# Altium schematic sheet schema1.SchDoc
size A3; ApprovedBy: CdB; CheckedBy: CdB; DrawnBy: RT; Engineer: CdB; Organization: Faber Electronics B.V.; Address1: Th. Dobbeweg 1,; Address2: 6883 GN Velp,; Address3: Netherlands; Address4: T: 026-38 46 800; DocumentNumber: 1; Revision: 2.1.4; SheetNumber: 1; SheetTotal: 6; Status: Final; PageSetup: Record=PageOptions|CenterHorizontal=True|CenterVertical=True|PrintScale=1.01|XCorrection=1.00|YCorrection=1.00|PrintKind=1|BorderSize=5000000|LeftOffset=0|BottomOffset=0|Orientation=2|PaperLength=1000|PaperWidth=1000|Scale=100|PaperSource=7|PrintQuality=1200|MediaType=1|DitherType=10|PaperKind=A3 (297 x 420mm)|PrintScaleMode=1
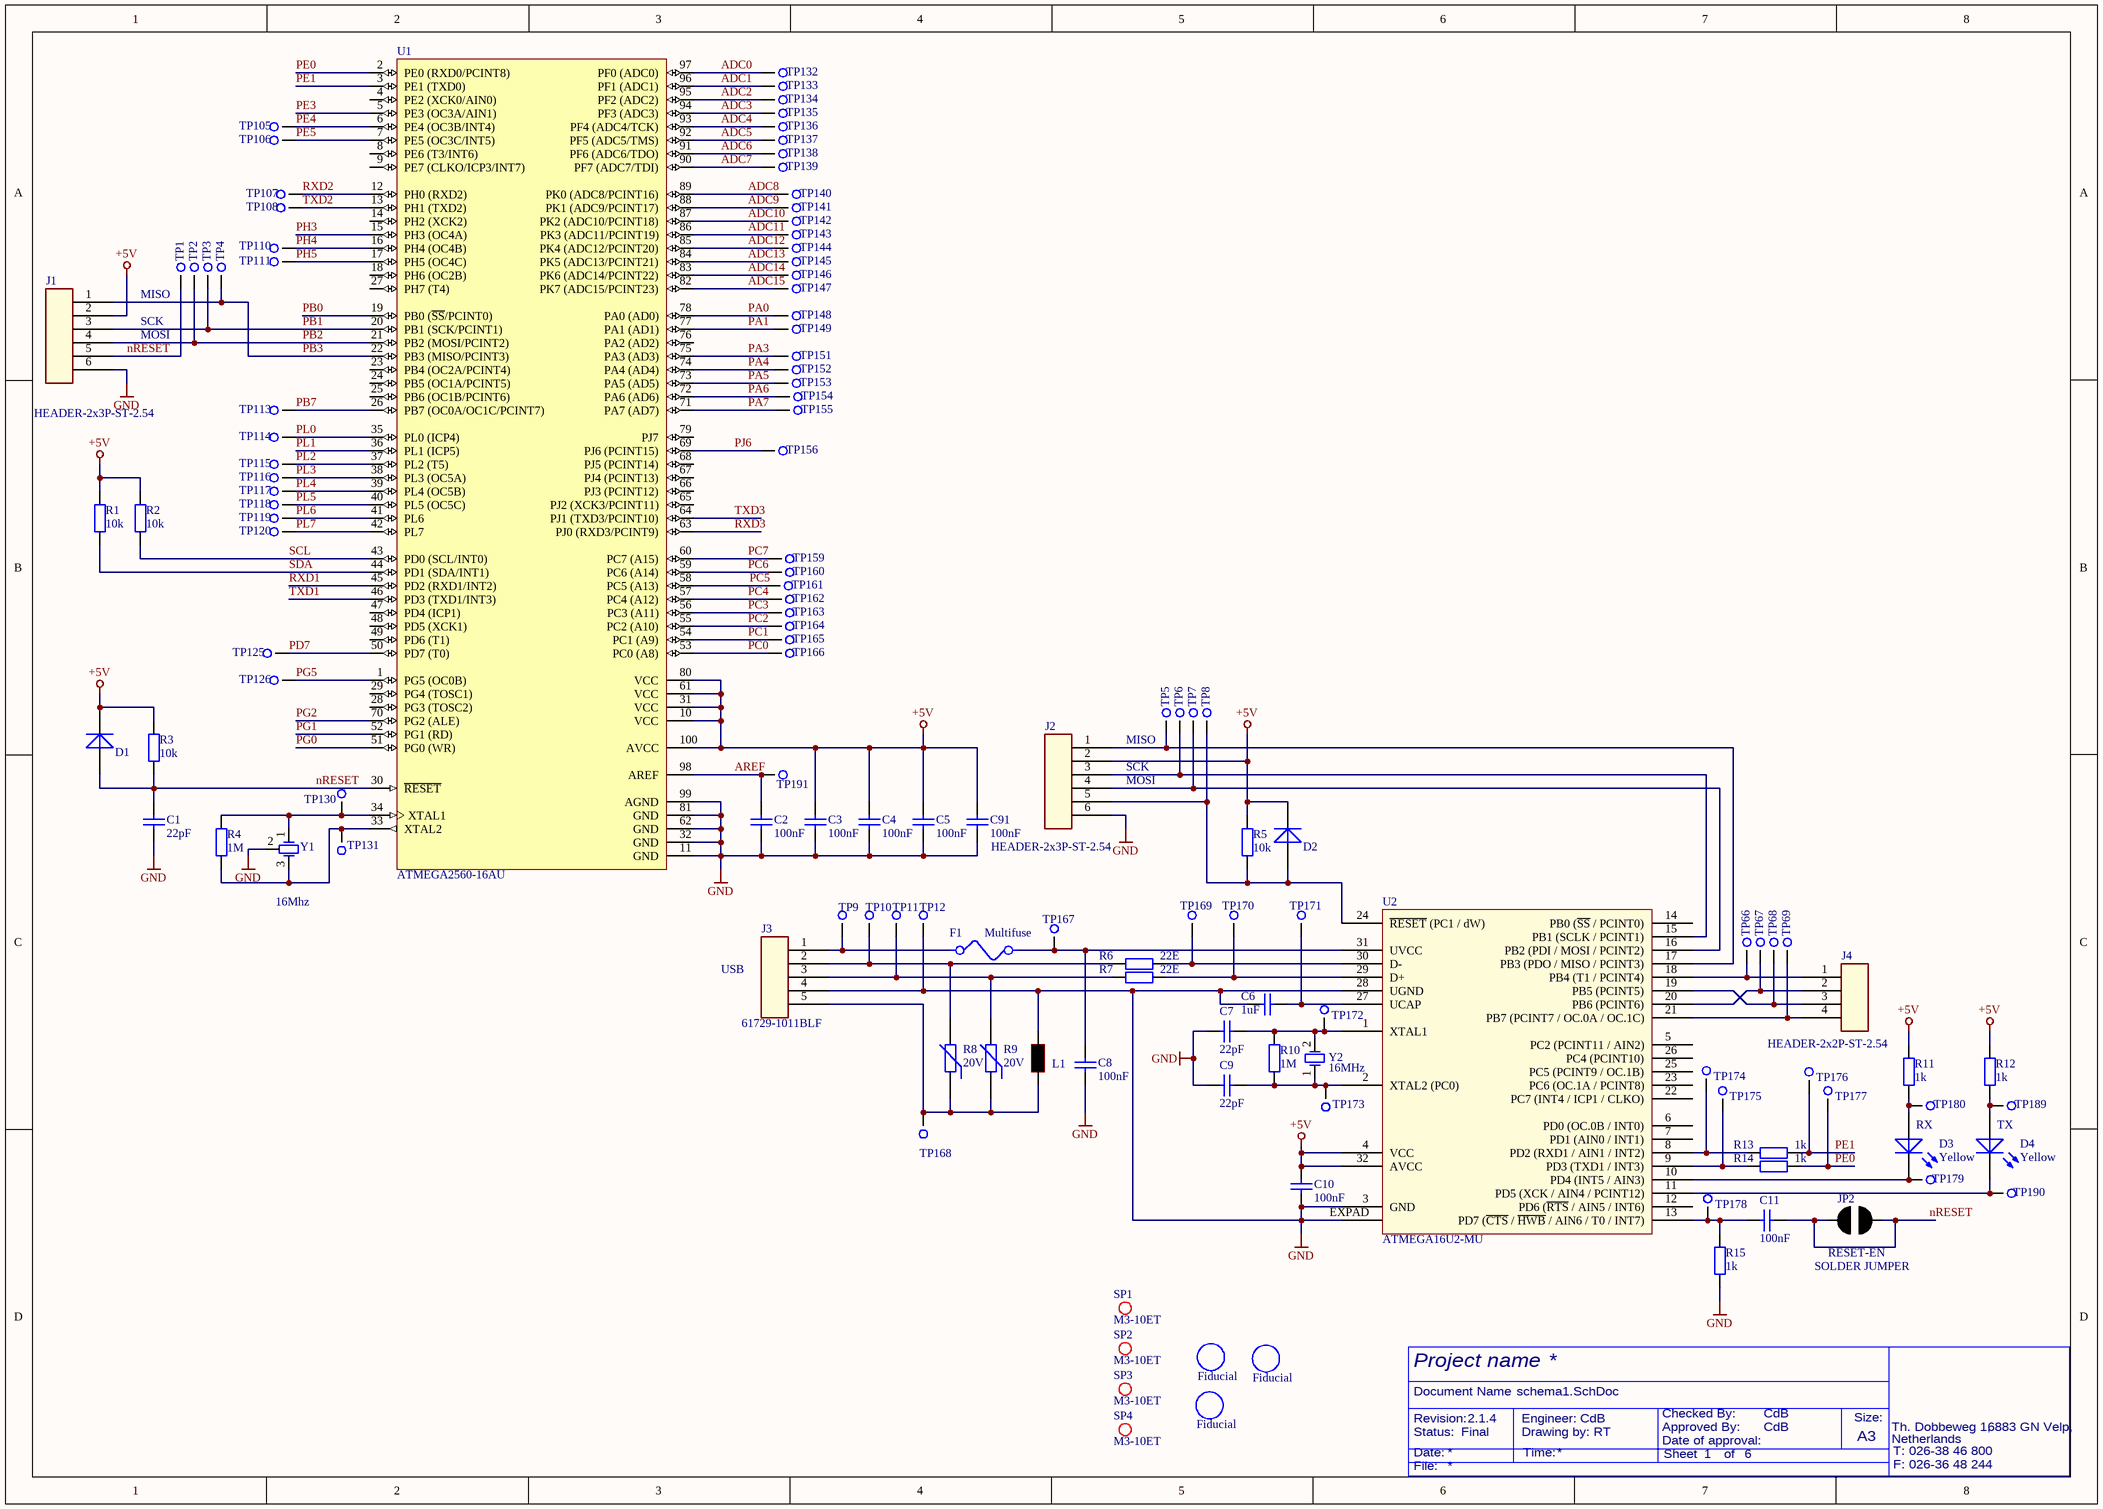
[diagram p0: schema1.SchDoc]

## Parts
C1  22pF  [C0603]
C2  100nF  [C0603]
C3  100nF  [C0603]
C4  100nF  [C0603]
C5  100nF  [C0603]
C6  1uF  [C0603]
C7  22pF  [C0603]
C8  100nF  [C0603]
C9  22pF  [C0603]
C10  100nF  [C0603]
C11  100nF  [C0603]
C91  100nF  [C0603]
D1  1N4148  [SOD323]  (value not drawn)
D2  1N4148  [SOD323]  (value not drawn)
D3  Yellow  [LED0805-YELLOW]
D4  Yellow  [LED0805-YELLOW]
F1  Multifuse  [Multifuse1812]
Fid1  Fiducial  [Fiducial]  (no BOM)
Fid2  Fiducial  [Fiducial]  (no BOM)
Fid3  Fiducial  [Fiducial]  (no BOM)
J1  HEADER-2x3P-ST-2.54  [HEADER-2x3P-ST-2.54]
J2  HEADER-2x3P-ST-2.54  [HEADER-2x3P-ST-2.54]
J3  61729-1011BLF  [61729-1011BLF]
J4  HEADER-2x2P-ST-2.54  [HEADER-2x2P-ST-2.54]
JP2  SOLDER JUMPER  [JUMPER 2 SOLDER]
L1  Bead  [L0805]  (value not drawn)
R1  10k  [R0603]
R2  10k  [R0603]
R3  10k  [R0603]
R4  1M  [R0603]
R5  10k  [R0603]
R6  22E  [R0603]
R7  22E  [R0603]
R8  20V  [R0603]
R9  20V  [R0603]
R10  1M  [R0603]
R11  1k  [R0603]
R12  1k  [R0603]
R13  1k  [R0603]
R14  1k  [R0603]
R15  1k  [R0603]
SP1  M3-10ET  [Spacer M3-10ET]
SP2  M3-10ET  [Spacer M3-10ET]
SP3  M3-10ET  [Spacer M3-10ET]
SP4  M3-10ET  [Spacer M3-10ET]
TP1  Testpoint  [Testpoint]  (value not drawn)
TP2  Testpoint  [Testpoint]  (value not drawn)
TP3  Testpoint  [Testpoint]  (value not drawn)
TP4  Testpoint  [Testpoint]  (value not drawn)
TP5  Testpoint  [Testpoint]  (value not drawn)
TP6  Testpoint  [Testpoint]  (value not drawn)
TP7  Testpoint  [Testpoint]  (value not drawn)
TP8  Testpoint  [Testpoint]  (value not drawn)
TP9  Testpoint  [Testpoint]  (value not drawn)
TP10  Testpoint  [Testpoint]  (value not drawn)
TP11  Testpoint  [Testpoint]  (value not drawn)
TP12  Testpoint  [Testpoint]  (value not drawn)
TP66  Testpoint  [Testpoint]  (value not drawn)
TP67  Testpoint  [Testpoint]  (value not drawn)
TP68  Testpoint  [Testpoint]  (value not drawn)
TP69  Testpoint  [Testpoint]  (value not drawn)
TP105  Testpoint 1.6mm  [Testpoint 1.6mm]  (value not drawn)
TP106  Testpoint 1.6mm  [Testpoint 1.6mm]  (value not drawn)
TP107  Testpoint 1.6mm  [Testpoint 1.6mm]  (value not drawn)
TP108  Testpoint 1.6mm  [Testpoint 1.6mm]  (value not drawn)
TP110  Testpoint 1.6mm  [Testpoint 1.6mm]  (value not drawn)
TP111  Testpoint 1.6mm  [Testpoint 1.6mm]  (value not drawn)
TP113  Testpoint 1.6mm  [Testpoint 1.6mm]  (value not drawn)
TP114  Testpoint 1.6mm  [Testpoint 1.6mm]  (value not drawn)
TP115  Testpoint 1.6mm  [Testpoint 1.6mm]  (value not drawn)
TP116  Testpoint 1.6mm  [Testpoint 1.6mm]  (value not drawn)
TP117  Testpoint 1.6mm  [Testpoint 1.6mm]  (value not drawn)
TP118  Testpoint 1.6mm  [Testpoint 1.6mm]  (value not drawn)
TP119  Testpoint 1.6mm  [Testpoint 1.6mm]  (value not drawn)
TP120  Testpoint 1.6mm  [Testpoint 1.6mm]  (value not drawn)
TP125  Testpoint 1.6mm  [Testpoint 1.6mm]  (value not drawn)
TP126  Testpoint 1.6mm  [Testpoint 1.6mm]  (value not drawn)
TP130  Testpoint 1.6mm  [Testpoint 1.6mm]  (value not drawn)
TP131  Testpoint 1.6mm  [Testpoint 1.6mm]  (value not drawn)
TP132  Testpoint 1.6mm  [Testpoint 1.6mm]  (value not drawn)
TP133  Testpoint 1.6mm  [Testpoint 1.6mm]  (value not drawn)
TP134  Testpoint 1.6mm  [Testpoint 1.6mm]  (value not drawn)
TP135  Testpoint 1.6mm  [Testpoint 1.6mm]  (value not drawn)
TP136  Testpoint 1.6mm  [Testpoint 1.6mm]  (value not drawn)
TP137  Testpoint 1.6mm  [Testpoint 1.6mm]  (value not drawn)
TP138  Testpoint 1.6mm  [Testpoint 1.6mm]  (value not drawn)
TP139  Testpoint 1.6mm  [Testpoint 1.6mm]  (value not drawn)
TP140  Testpoint 1.6mm  [Testpoint 1.6mm]  (value not drawn)
TP141  Testpoint 1.6mm  [Testpoint 1.6mm]  (value not drawn)
TP142  Testpoint 1.6mm  [Testpoint 1.6mm]  (value not drawn)
TP143  Testpoint 1.6mm  [Testpoint 1.6mm]  (value not drawn)
TP144  Testpoint 1.6mm  [Testpoint 1.6mm]  (value not drawn)
TP145  Testpoint 1.6mm  [Testpoint 1.6mm]  (value not drawn)
TP146  Testpoint 1.6mm  [Testpoint 1.6mm]  (value not drawn)
TP147  Testpoint 1.6mm  [Testpoint 1.6mm]  (value not drawn)
TP148  Testpoint 1.6mm  [Testpoint 1.6mm]  (value not drawn)
TP149  Testpoint 1.6mm  [Testpoint 1.6mm]  (value not drawn)
TP151  Testpoint 1.6mm  [Testpoint 1.6mm]  (value not drawn)
TP152  Testpoint 1.6mm  [Testpoint 1.6mm]  (value not drawn)
TP153  Testpoint 1.6mm  [Testpoint 1.6mm]  (value not drawn)
TP154  Testpoint 1.6mm  [Testpoint 1.6mm]  (value not drawn)
TP155  Testpoint 1.6mm  [Testpoint 1.6mm]  (value not drawn)
TP156  Testpoint 1.6mm  [Testpoint 1.6mm]  (value not drawn)
TP159  Testpoint 1.6mm  [Testpoint 1.6mm]  (value not drawn)
TP160  Testpoint 1.6mm  [Testpoint 1.6mm]  (value not drawn)
TP161  Testpoint 1.6mm  [Testpoint 1.6mm]  (value not drawn)
TP162  Testpoint 1.6mm  [Testpoint 1.6mm]  (value not drawn)
TP163  Testpoint 1.6mm  [Testpoint 1.6mm]  (value not drawn)
TP164  Testpoint 1.6mm  [Testpoint 1.6mm]  (value not drawn)
TP165  Testpoint 1.6mm  [Testpoint 1.6mm]  (value not drawn)
TP166  Testpoint 1.6mm  [Testpoint 1.6mm]  (value not drawn)
TP167  Testpoint 1.6mm  [Testpoint 1.6mm]  (value not drawn)
TP168  Testpoint 1.6mm  [Testpoint 1.6mm]  (value not drawn)
TP169  Testpoint 1.6mm  [Testpoint 1.6mm]  (value not drawn)
TP170  Testpoint 1.6mm  [Testpoint 1.6mm]  (value not drawn)
TP171  Testpoint 1.6mm  [Testpoint 1.6mm]  (value not drawn)
TP172  Testpoint 1.6mm  [Testpoint 1.6mm]  (value not drawn)
TP173  Testpoint 1.6mm  [Testpoint 1.6mm]  (value not drawn)
TP174  Testpoint 1.6mm  [Testpoint 1.6mm]  (value not drawn)
TP175  Testpoint 1.6mm  [Testpoint 1.6mm]  (value not drawn)
TP176  Testpoint 1.6mm  [Testpoint 1.6mm]  (value not drawn)
TP177  Testpoint 1.6mm  [Testpoint 1.6mm]  (value not drawn)
TP178  Testpoint 1.6mm  [Testpoint 1.6mm]  (value not drawn)
TP179  Testpoint 1.6mm  [Testpoint 1.6mm]  (value not drawn)
TP180  Testpoint 1.6mm  [Testpoint 1.6mm]  (value not drawn)
TP189  Testpoint 1.6mm  [Testpoint 1.6mm]  (value not drawn)
TP190  Testpoint 1.6mm  [Testpoint 1.6mm]  (value not drawn)
TP191  Testpoint 1.6mm  [Testpoint 1.6mm]  (value not drawn)
U1  ATMEGA2560-16AU  [TSQFP50P1600X1600X120-100N]
U2  ATMEGA16U2-MU  [QFN50P500X500X100-32-EX]
Y1  16Mhz  [CSTC]
Y2  16MHz  [XT49M-2016M]

## Nets
+5V: C3.2 C4.2 C5.2 C10.2 C91.2 D1.2(K) D2.2(K) J1.2 J2.2 R1.1 R2.1 R3.2 R5.1 R11.2 R12.2 U1.10(VCC) U1.31(VCC) U1.61(VCC) U1.80(VCC) U1.100(AVCC) U2.4(VCC) U2.32(AVCC)
GND: C1.1 C2.1 C3.1 C4.1 C5.1 C6.1 C7.1 C8.1 C9.1 C10.1 C91.1 J1.6 J2.6 J3.4 L1.1 R15.2 TP12.1 U1.11(GND) U1.32(GND) U1.62(GND) U1.81(GND) U1.99(AGND) U2.3(GND) U2.28(UGND) U2.EXPAD Y1.2
ADC0: TP132.1 U1.97(PF0_(ADC0))
ADC1: TP133.1 U1.96(PF1_(ADC1))
ADC2: TP134.1 U1.95(PF2_(ADC2))
ADC3: TP135.1 U1.94(PF3_(ADC3))
ADC4: TP136.1 U1.93(PF4_(ADC4/TCK))
ADC5: TP137.1 U1.92(PF5_(ADC5/TMS))
ADC6: TP138.1 U1.91(PF6_(ADC6/TDO))
ADC7: TP139.1 U1.90(PF7_(ADC7/TDI))
ADC8: TP140.1 U1.89(PK0_(ADC8/PCINT16))
ADC9: TP141.1 U1.88(PK1_(ADC9/PCINT17))
ADC10: TP142.1 U1.87(PK2_(ADC10/PCINT18))
ADC11: TP143.1 U1.86(PK3_(ADC11/PCINT19))
ADC12: TP144.1 U1.85(PK4_(ADC12/PCINT20))
ADC13: TP145.1 U1.84(PK5_(ADC13/PCINT21))
ADC14: TP146.1 U1.83(PK6_(ADC14/PCINT22))
ADC15: TP147.1 U1.82(PK7_(ADC15/PCINT23))
AREF: C2.2 TP191.1 U1.98(AREF)
nRESET: C1.2 C11.1 D1.1(A) J1.5 JP2.1 JP2.2 R3.1 TP1.1 U1.30(~{RESET})
PA0: TP148.1 U1.78(PA0_(AD0))
PA1: TP149.1 U1.77(PA1_(AD1))
PA3: TP151.1 U1.75(PA3_(AD3))
PA4: TP152.1 U1.74(PA4_(AD4))
PA5: TP153.1 U1.73(PA5_(AD5))
PA6: TP154.1 U1.72(PA6_(AD6))
PA7: TP155.1 U1.71(PA7_(AD7))
PB0: U1.19(PB0_(~{SS}/PCINT0))
PB1: J1.3 TP3.1 U1.20(PB1_(SCK/PCINT1))
PB2: J1.4 TP2.1 U1.21(PB2_(MOSI/PCINT2))
PB3: J1.1 TP4.1 U1.22(PB3_(MISO/PCINT3))
PB7: TP113.1 U1.26(PB7_(OC0A/OC1C/PCINT7))
PC0: TP166.1 U1.53(PC0_(A8))
PC1: TP165.1 U1.54(PC1_(A9))
PC2: TP164.1 U1.55(PC2_(A10))
PC3: TP163.1 U1.56(PC3_(A11))
PC4: TP162.1 U1.57(PC4_(A12))
PC5: TP161.1 U1.58(PC5_(A13))
PC6: TP160.1 U1.59(PC6_(A14))
PC7: TP159.1 U1.60(PC7_(A15))
PD7: TP125.1 U1.50(PD7_(T0))
PE0: R14.2 TP177.1 U1.2(PE0_(RXD0/PCINT8))
PE1: R13.2 TP176.1 U1.3(PE1_(TXD0))
PE3: U1.5(PE3_(OC3A/AIN1))
PE4: TP105.1 U1.6(PE4_(OC3B/INT4))
PE5: TP106.1 U1.7(PE5_(OC3C/INT5))
PG0: U1.51(PG0_(WR))
PG1: U1.52(PG1_(RD))
PG2: U1.70(PG2_(ALE))
PG5: TP126.1 U1.1(PG5_(OC0B))
PH3: U1.15(PH3_(OC4A))
PH4: TP110.1 U1.16(PH4_(OC4B))
PH5: TP111.1 U1.17(PH5_(OC4C))
PJ6: TP156.1 U1.69(PJ6_(PCINT15))
PL0: TP114.1 U1.35(PL0_(ICP4))
PL1: U1.36(PL1_(ICP5))
PL2: TP115.1 U1.37(PL2_(T5))
PL3: TP116.1 U1.38(PL3_(OC5A))
PL4: TP117.1 U1.39(PL4_(OC5B))
PL5: TP118.1 U1.40(PL5_(OC5C))
PL6: TP119.1 U1.41(PL6)
PL7: TP120.1 U1.42(PL7)
RXD1: U1.45(PD2_(RXD1/INT2))
RXD2: TP107.1 U1.12(PH0_(RXD2))
RXD3: U1.63(PJ0_(RXD3/PCINT9))
SCL: R2.2 U1.43(PD0_(SCL/INT0))
SDA: R1.2 U1.44(PD1_(SDA/INT1))
TXD1: U1.46(PD3_(TXD1/INT3))
TXD2: TP108.1 U1.13(PH1_(TXD2))
TXD3: U1.64(PJ1_(TXD3/PCINT10))
NetC6_2: C6.2 TP171.1 U2.27(UCAP)
NetC7_2: C7.2 R10.2 TP172.1 U2.1(XTAL1) Y2.2
NetC8_2: C8.2 F1.2 TP167.1 U2.31(UVCC)
NetC9_2: C9.2 R10.1 TP173.1 U2.2(XTAL2_(PC0)) Y2.1
NetC11_2: C11.2 R15.1 TP178.1 U2.13(PD7_(~{CTS}_/_~{HWB}_/_AIN6_/_T0_/_INT7))
NetD2_1: D2.1(A) J2.5 R5.2 TP8.1 U2.24(~{RESET}_(PC1_/_dW))
NetD3_1: D3.1(A) R11.1 TP180.1
NetD3_2: D3.2(K) TP179.1 U2.10(PD4_(INT5_/_AIN3))
NetD4_1: D4.1(A) R12.1 TP189.1
NetD4_2: D4.2(K) TP190.1 U2.11(PD5_(XCK_/_AIN4_/_PCINT12))
NetF1_1: F1.1 J3.1 TP9.1
NetJ2_1: J2.1 TP5.1 U2.17(PB3_(PDO_/_MISO_/_PCINT3))
NetJ2_3: J2.3 TP6.1 U2.15(PB1_(SCLK_/_PCINT1))
NetJ2_4: J2.4 TP7.1 U2.16(PB2_(PDI_/_MOSI_/_PCINT2))
NetJ3_2: J3.2 R6.1 R8.2 TP10.1
NetJ3_3: J3.3 R7.1 R9.2 TP11.1
NetJ3_5: J3.5 L1.2 R8.1 R9.1 TP168.1
NetJ4_1: J4.1 TP66.1 U2.18(PB4_(T1_/_PCINT4))
NetJ4_2: J4.2 TP67.1 U2.20(PB6_(PCINT6))
NetJ4_3: J4.3 TP68.1 U2.19(PB5_(PCINT5))
NetJ4_4: J4.4 TP69.1 U2.21(PB7_(PCINT7_/_OC.0A_/_OC.1C))
NetR4_1: R4.1 TP131.1 U1.33(XTAL2) Y1.3
NetR4_2: R4.2 TP130.1 U1.34(XTAL1) Y1.1
NetR6_2: R6.2 TP169.1 U2.30(D-)
NetR7_2: R7.2 TP170.1 U2.29(D+)
NetR13_1: R13.1 TP174.1 U2.8(PD2_(RXD1_/_AIN1_/_INT2))
NetR14_1: R14.1 TP175.1 U2.9(PD3_(TXD1_/_INT3))

Not connected (* = marked no-connect by the designer): U1 4(PE2_(XCK0/AIN0)) 8(PE6_(T3/INT6)) 9(PE7_(CLKO/ICP3/INT7)) 14(PH2_(XCK2)) 18(PH6_(OC2B)) 23(PB4_(OC2A/PCINT4)) 24(PB5_(OC1A/PCINT5)) 25(PB6_(OC1B/PCINT6)) 27(PH7_(T4)) 28(PG3_(TOSC2)) 29(PG4_(TOSC1)) 47(PD4_(ICP1)) 48(PD5_(XCK1)) 49(PD6_(T1)) 65(PJ2_(XCK3/PCINT11)) 66(PJ3_(PCINT12)) 67(PJ4_(PCINT13)) 68(PJ5_(PCINT14)) 76(PA2_(AD2)) 79(PJ7); U2 5(PC2_(PCINT11_/_AIN2)) 6(PD0_(OC.0B_/_INT0)) 7(PD1_(AIN0_/_INT1)) 12(PD6_(~{RTS}_/_AIN5_/_INT6)) 14(PB0_(~{SS}_/_PCINT0)) 22(PC7_(INT4_/_ICP1_/_CLKO)) 23(PC6_(OC.1A_/_PCINT8)) 25(PC5_(PCINT9_/_OC.1B)) 26(PC4_(PCINT10))

## Notes on the sheet
- MISO
- SCK
- MOSI
- (near J3) USB
- RX
- TX
- (near JP2) RESET-EN
- Project name
- Document Name
- Revision:
- Date:
- Status:
- Engineer:
- Drawing by:
- Time:
- Approved By:
- Checked By:
- Date of approval:
- Sheet
- of
- Size:
- A3
- File:
- F: 026-36 48 244

## Library data of the parts
C1 C7 C9 = Library_CAP-0008: RO C0G 22pF 2% 50V  0603; Faber ItemCode: 35321100; ID: Library_CAP-0008; Value: 22pF
C2-C5 C8 C10 C11 C91 = Library_CAP-0002: RO X7R 100nF 10% 50V 0603; Faber ItemCode: 45068500; ID: Library_CAP-0002; Value: 100nF
C6 = Library_CAP-0006: RO X5R 1uF 10% 10V 0603; Faber ItemCode: 36310600; ID: Library_CAP-0006; Value: 1uF
D1 D2 = Library_DIO-0002: RO DIODE 1N4148WS-V-GS08 SOT-323  VISHAY; Faber ItemCode: 36650500; Info: Small Signal Fast Switching Diode; Mfg: VISHAY; ID: Library_DIO-0002; Value: 1N4148
D3 D4 = Library_LED-0003: RO LED GEEL HSMY-C170 0805  AVAGO; Faber ItemCode: 35160800; ID: Library_LED-0003; Mfg: AVAGO; Mfg code: HSMY-C170; Value: Yellow
F1 = Library_FUSE-0001: RO ZEK MULTI 500MA SMD 1812 MF-MSMF050-2 BOURNS; Faber ItemCode: 35502800; Info: MULTIFUSE, SMD, 0.5A; Value: 0.5A; ID: Library_FUSE-0001; Mfg: BOURNS; Mfg code: MF-MSMF050-2
Fid1-Fid3 = Library_MISC-0003: ID: Library_MISC-0003; Faber ItemCode: -; Mfg: -; Mfg code: -; Value: Fiducial
J1 J2 = Library_CON-0003: RO CONN PR HDR 2X3P H4B-06DS-0000 INT; Faber ItemCode: 35149900; ID: Library_CON-0003; Value: HEADER-2x3P-ST-2.54
J3 = Library_CON-0001: RO CONN PR USB-B HKS 61729-1011BLF FCI; Faber ItemCode: 36924400; ID: Library_CON-0001; Mfg: FCI; Mfg code: 61729-1011BLF; Value: 61729-1011BLF
J4 = Library_CON-0011: HDR 2X2P; ID: Library_CON-0011; Value: HEADER-2x2P-ST-2.54
JP2 = Library_CON-0010: ID: Library_CON-0010; Mfg: -; Mfg code: -; Value: SOLDER JUMPER
L1 = Library_COIL-0001: RO FERRIET BLM21PG221SN1D  0805; Faber ItemCode: 36571200; ID: Library_COIL-0001; Value: Bead
R1-R3 R5 = Library_RES-0001: RO RES 10k0 1% 0,063W  0603; Faber ItemCode: 36084500; ID: Library_RES-0001; Info: Resistor; Value: 10k
R4 R10 = Library_RES-0003: RO RES 1M0 1% 0,1W 0603; Faber ItemCode: 36059900; ID: Library_RES-0003; Info: Resistor; Value: 1M
R6 R7 = Library_RES-0007: RO RES 22E0 1% 0,063W 0603; Faber ItemCode: 36108300; ID: Library_RES-0007; Info: Resistor; Value: 22E
R8 R9 = Library_RES-0012: RO VDR 0603 CG0603MLC-05E; Mfg: BOURNS; Faber ItemCode: 36925900; ID: Library_RES-0012; Mfg code: CG0603MLC-05E; Info: Varistor; Value: 20V
R11-R15 = Library_RES-0004: RO RES 1k0 1% 0,1W  0603; Faber ItemCode: 34637900; ID: Library_RES-0004; Info: Resistor; Value: 1k
SP1 = Spacer M3-10ET: MOER-SMD SMTSO-M3-10ET  PEM; Faber ItemCode: 36462900; Bestel grote: 300; Prijs: 0.4311; Mfg: PEM; Mfg code: SMTSO-M3-10ET; Value: -; Remarks: -; Supplier: Onkenhout & Onkenhout; Supplier code: SMTSO-M3-10ET; Max soldering temp: -; SMD: Yes; Faber Artikelomschrijving: MOER-SMD SMTSO-M3-10ET  PEM
SP2-SP4 = Spacer M3-10ET: Spacer SMTSO-M3-10ET; Faber ItemCode: 36462900; Mfg: PEM; Faber Artikelomschrijving: MOER-SMD SMTSO-M3-10ET  PEM; Bestel grote: 300; Prijs: 0.4311; Mfg code: SMTSO-M3-10ET; Value: -; Remarks: -; Supplier: Onkenhout & Onkenhout; Supplier code: SMTSO-M3-10ET; Max soldering temp: -; SMD: Yes
TP1-TP12 TP66-TP69 = Library_MISC-0001: Info: Testpoint, 2mm, round; ID: Library_MISC-0001; Faber ItemCode: -; Mfg: -; Mfg code: -; Value: Testpoint
TP105-TP108 TP110 TP111 TP113-TP120 TP125 TP126 TP130-TP149 TP151-TP156 TP159-TP180 TP189-TP191 = Testpoint 1.6mm: ID: Library_MISC-0001; Faber ItemCode: -; Mfg: -; Mfg code: -; Info: Testpoint 1.6mm; Value: Testpoint 1.6mm
U1 = Library_ICS-0001: RO IC ATMEGA2560-16AU TQFP-100 ATMEL; Info: 8-bit Atmel Microcontroller with 256KB Flash, 4KB EEPROM, 8KB RAM; Faber ItemCode: 36924700; Mfg: Atmel; Mfg code: ATMEGA2560-16AU; ID: Library_ICS-0001; Value: ATMEGA2560-16AU
U2 = Library_ICS-0004: RO IC ATMEGA16U2-MU QFN-32 ATMEL; Info: 8-bit Microcontroller with 16K Bytes of ISP Flash and USB Controller; Faber ItemCode: 36924600; ID: Library_ICS-0004; Mfg: Atmel; Mfg code: ATMEGA16U2-MU; Value: ATMEGA16U2-MU
Y1 = LIBRARY_XTAL-0002: RO KRIS 16MHz CSTCE16M0V53-R0 SMD MURATA; Info: Build in cap; Faber ItemCode: 36925600; ID: LIBRARY_XTAL-0002; Mfg: MURATA; Mfg code: CSTCE16M0V53-R0; Value: 16Mhz
Y2 = LIBRARY_XTAL-0001: RO KRISTAL 16.0MHz  HC49/4HSMX  SMD CMAC; Info: Low Profile SMD Type Crystal Units; Faber ItemCode: 36298900; ID: LIBRARY_XTAL-0001; Mfg: CMAC; Mfg code: XT49M-2016M; Value: 16MHz